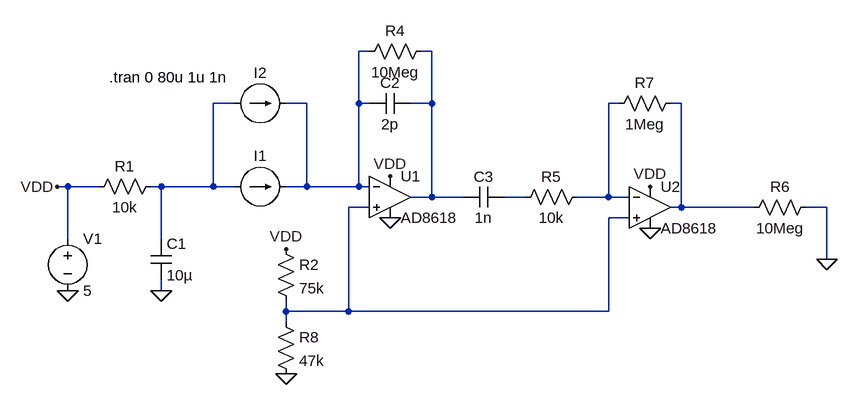
[diagram p0: schematic RadiationSensor.asc]
RadiationSensor.asc, the LTspice schematic file:
Version 4
SHEET 1 1448 900
WIRE 416 -176 400 -176
WIRE 512 -176 496 -176
WIRE 208 -96 176 -96
WIRE 320 -96 288 -96
WIRE 400 -96 400 -176
WIRE 416 -96 400 -96
WIRE 512 -96 512 -176
WIRE 512 -96 480 -96
WIRE 800 -96 784 -96
WIRE 896 -96 880 -96
WIRE -48 32 -64 32
WIRE 0 32 -48 32
WIRE 96 32 80 32
WIRE 176 32 176 -96
WIRE 176 32 96 32
WIRE 208 32 176 32
WIRE 320 32 320 -96
WIRE 320 32 288 32
WIRE 400 32 400 -96
WIRE 400 32 320 32
WIRE 416 32 400 32
WIRE 512 48 512 -96
WIRE 512 48 480 48
WIRE 560 48 512 48
WIRE 656 48 624 48
WIRE 784 48 784 -96
WIRE 784 48 736 48
WIRE 816 48 784 48
WIRE 416 64 384 64
WIRE 896 64 896 -96
WIRE 896 64 880 64
WIRE 1008 64 896 64
WIRE 1120 64 1088 64
WIRE 816 80 784 80
WIRE -48 112 -48 32
WIRE 96 112 96 32
WIRE 1120 144 1120 64
WIRE 96 192 96 176
WIRE 288 224 288 208
WIRE 384 224 384 64
WIRE 384 224 288 224
WIRE 784 224 784 80
WIRE 784 224 384 224
WIRE 288 240 288 224
FLAG -48 192 0
FLAG 96 192 0
FLAG -64 32 VDD
FLAG 448 16 VDD
FLAG 848 32 VDD
FLAG 288 128 VDD
FLAG 848 96 0
FLAG 448 80 0
FLAG 288 320 0
FLAG 1120 144 0
SYMBOL voltage -48 96 R0
WINDOW 123 0 0 Left 0
WINDOW 39 0 0 Left 0
SYMATTR InstName V1
SYMATTR Value 5
SYMBOL res 96 16 R90
WINDOW 0 0 56 VBottom 2
WINDOW 3 32 56 VTop 2
SYMATTR InstName R1
SYMATTR Value 10k
SYMBOL cap 80 112 R0
SYMATTR InstName C1
SYMATTR Value 10µ
SYMBOL current 208 32 R270
WINDOW 0 32 40 VTop 2
WINDOW 3 -32 40 Invisible 2
WINDOW 123 0 0 Left 0
WINDOW 39 0 0 Left 0
SYMATTR InstName I1
SYMATTR Value PULSE(0n 5n 3u 10n 10n 6u 0 1)
SYMBOL cap 480 -112 R90
WINDOW 0 0 32 VBottom 2
WINDOW 3 32 32 VTop 2
SYMATTR InstName C2
SYMATTR Value 2p
SYMBOL res 512 -192 R90
WINDOW 0 0 56 VBottom 2
WINDOW 3 32 56 VTop 2
SYMATTR InstName R4
SYMATTR Value 10Meg
SYMBOL cap 624 32 R90
WINDOW 0 0 32 VBottom 2
WINDOW 3 32 32 VTop 2
SYMATTR InstName C3
SYMATTR Value 1n
SYMBOL res 752 32 R90
WINDOW 0 0 56 VBottom 2
WINDOW 3 32 56 VTop 2
SYMATTR InstName R5
SYMATTR Value 10k
SYMBOL res 896 -112 R90
WINDOW 0 0 56 VBottom 2
WINDOW 3 32 56 VTop 2
SYMATTR InstName R7
SYMATTR Value 1Meg
SYMBOL res 1104 48 R90
WINDOW 0 0 56 VBottom 2
WINDOW 3 32 56 VTop 2
SYMATTR InstName R6
SYMATTR Value 10Meg
SYMBOL res 272 112 R0
SYMATTR InstName R2
SYMATTR Value 75k
SYMBOL res 272 224 R0
SYMATTR InstName R8
SYMATTR Value 47k
SYMBOL Opamps\\AD8618 448 -16 R0
SYMATTR InstName U1
SYMBOL Opamps\\AD8618 848 0 R0
SYMATTR InstName U2
SYMBOL current 208 -96 R270
WINDOW 0 32 40 VTop 2
WINDOW 3 -32 40 Invisible 2
WINDOW 123 0 0 Left 0
WINDOW 39 0 0 Left 0
SYMATTR InstName I2
SYMATTR Value SINE(0 1n 6meg)
TEXT 16 -136 Left 2 !.tran 0 80u 1u 1n

The netlist it stands for:
* RadiationSensor.asc
V1 VDD 0 5
R1 N003 VDD 10k
C1 N003 0 10µ
I1 N003 N001 PULSE(0n 5n 3u 10n 10n 6u 0 1)
C2 N002 N001 2p
R4 N002 N001 10Meg
C3 N006 N002 1n
R5 N004 N006 10k
R7 N005 N004 1Meg
R6 0 N005 10Meg
R2 VDD N007 75k
R8 N007 0 47k
XU1 N007 N001 VDD 0 N002 AD8618  ; pins In+ In- V+ V- OUT
XU2 N007 N004 VDD 0 N005 AD8618  ; pins In+ In- V+ V- OUT
I2 N003 N001 SINE(0 1n 6meg)
.tran 0 80u 1u 1n
.backanno
.end